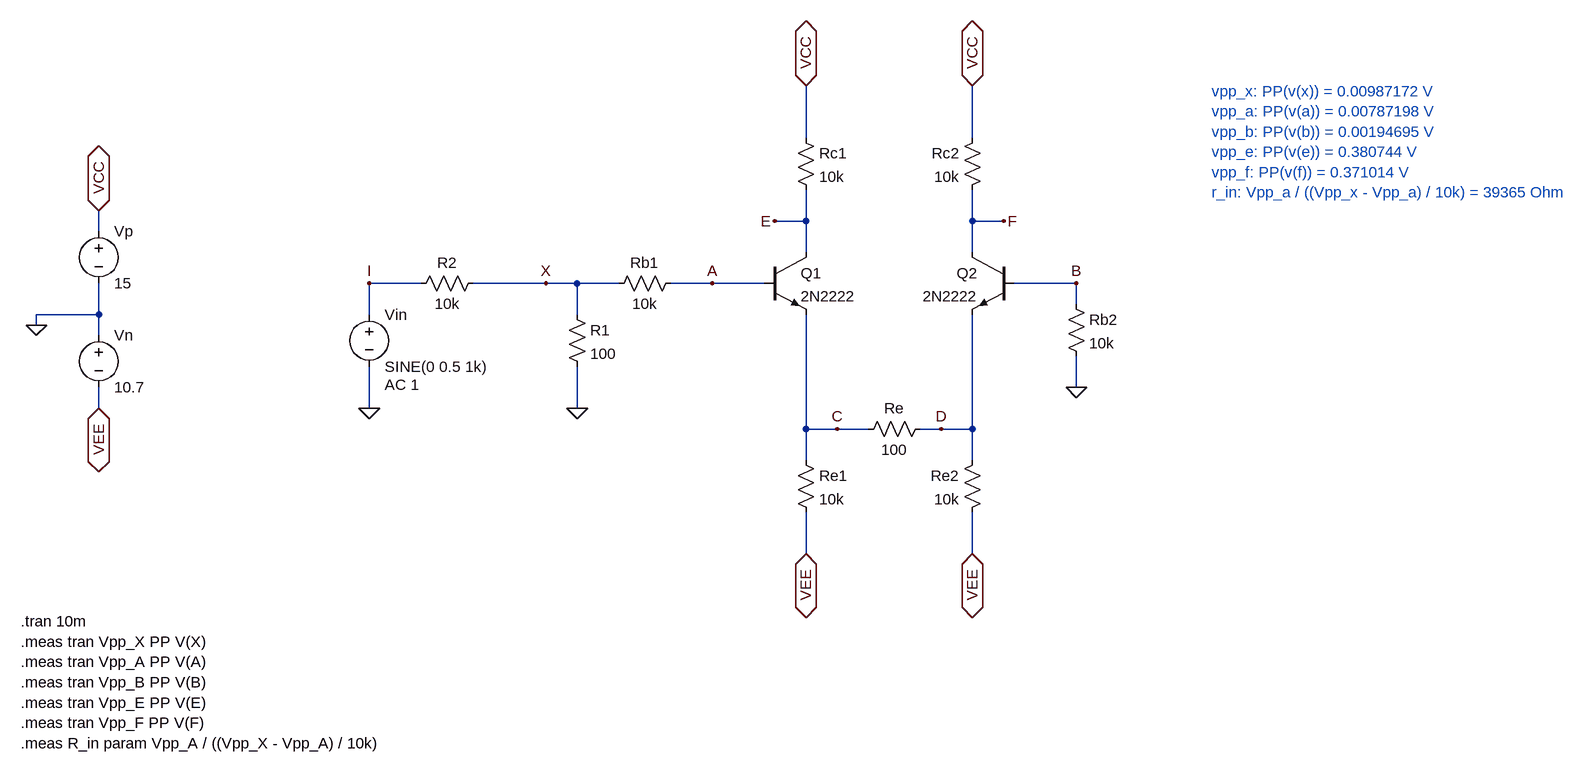
[diagram p0: schematic e1_3_b.asc]
e1_3_b.asc, the LTspice schematic file:
Version 4
SHEET 1 2376 928
WIRE 1136 0 1136 -80
WIRE 1392 0 1392 -80
WIRE 1136 128 1136 80
WIRE 1136 128 1088 128
WIRE 1392 128 1392 80
WIRE 1440 128 1392 128
WIRE 48 144 48 112
WIRE 1136 176 1136 128
WIRE 1392 176 1392 128
WIRE 544 224 464 224
WIRE 736 224 624 224
WIRE 784 224 736 224
WIRE 848 224 784 224
WIRE 992 224 928 224
WIRE 1072 224 992 224
WIRE 1552 224 1456 224
WIRE 1552 256 1552 224
WIRE 48 272 48 224
WIRE 48 272 -48 272
WIRE 464 272 464 224
WIRE 784 272 784 224
WIRE -48 288 -48 272
WIRE 48 304 48 272
WIRE 1552 384 1552 336
WIRE 48 416 48 384
WIRE 464 416 464 352
WIRE 784 416 784 352
WIRE 1136 448 1136 272
WIRE 1184 448 1136 448
WIRE 1232 448 1184 448
WIRE 1344 448 1312 448
WIRE 1392 448 1392 272
WIRE 1392 448 1344 448
WIRE 1136 496 1136 448
WIRE 1392 496 1392 448
WIRE 1136 640 1136 576
WIRE 1392 640 1392 576
FLAG -48 288 0
FLAG 48 112 VCC
IOPIN 48 112 BiDir
FLAG 48 416 VEE
IOPIN 48 416 BiDir
FLAG 784 416 0
FLAG 1136 -80 VCC
IOPIN 1136 -80 BiDir
FLAG 1088 128 E
FLAG 992 224 A
FLAG 1136 640 VEE
IOPIN 1136 640 BiDir
FLAG 1184 448 C
FLAG 1392 -80 VCC
IOPIN 1392 -80 BiDir
FLAG 1440 128 F
FLAG 1552 224 B
FLAG 1392 640 VEE
IOPIN 1392 640 BiDir
FLAG 1344 448 D
FLAG 1552 384 0
FLAG 464 416 0
FLAG 464 224 I
FLAG 736 224 X
SYMBOL voltage 48 128 R0
SYMATTR InstName Vp
SYMATTR Value 15
SYMBOL voltage 48 288 R0
SYMATTR InstName Vn
SYMATTR Value 10.7
SYMBOL npn 1072 176 R0
SYMATTR InstName Q1
SYMATTR Value 2N2222
SYMBOL res 1120 -16 R0
SYMATTR InstName Rc1
SYMATTR Value 10k
SYMBOL res 768 256 R0
SYMATTR InstName R1
SYMATTR Value 100
SYMBOL res 1120 480 R0
SYMATTR InstName Re1
SYMATTR Value 10k
SYMBOL npn 1456 176 M0
SYMATTR InstName Q2
SYMATTR Value 2N2222
SYMBOL res 1408 -16 M0
SYMATTR InstName Rc2
SYMATTR Value 10k
SYMBOL res 1408 480 M0
SYMATTR InstName Re2
SYMATTR Value 10k
SYMBOL voltage 464 256 R0
WINDOW 123 24 124 Left 2
WINDOW 39 0 0 Left 0
SYMATTR Value2 AC 1
SYMATTR InstName Vin
SYMATTR Value SINE(0 0.5 1k)
SYMBOL res 640 208 R90
WINDOW 0 0 56 VBottom 2
WINDOW 3 32 56 VTop 2
SYMATTR InstName R2
SYMATTR Value 10k
SYMBOL res 944 208 R90
WINDOW 0 0 56 VBottom 2
WINDOW 3 32 56 VTop 2
SYMATTR InstName Rb1
SYMATTR Value 10k
SYMBOL res 1536 240 R0
SYMATTR InstName Rb2
SYMATTR Value 10k
SYMBOL res 1328 432 R90
WINDOW 0 0 56 VBottom 2
WINDOW 3 32 56 VTop 2
SYMATTR InstName Re
SYMATTR Value 100
TEXT -72 744 Left 2 !.tran 10m\n.meas tran Vpp_X PP V(X)\n.meas tran Vpp_A PP V(A)\n.meas tran Vpp_B PP V(B)\n.meas tran Vpp_E PP V(E)\n.meas tran Vpp_F PP V(F)\n.meas R_in param Vpp_A / ((Vpp_X - Vpp_A) / 10k)
TEXT 1760 -72 Left 2 ;vpp_x: PP(v(x)) = 0.00987172 V\nvpp_a: PP(v(a)) = 0.00787198 V\nvpp_b: PP(v(b)) = 0.00194695 V\nvpp_e: PP(v(e)) = 0.380744 V\nvpp_f: PP(v(f)) = 0.371014 V\nr_in: Vpp_a / ((Vpp_x - Vpp_a) / 10k) = 39365 Ohm

The netlist it stands for:
* e1_3_b.asc
Vp VCC 0 15
Vn 0 VEE 10.7
Q1 E A C 0 2N2222
Rc1 VCC E 10k
R1 X 0 100
Re1 C VEE 10k
Q2 F B D 0 2N2222
Rc2 VCC F 10k
Re2 D VEE 10k
Vin I 0 SINE(0 0.5 1k) AC 1
R2 X I 10k
Rb1 A X 10k
Rb2 B 0 10k
Re D C 100
.model NPN NPN
.model PNP PNP
.lib standard.bjt
.tran 10m
.meas tran Vpp_X PP V(X)
.meas tran Vpp_A PP V(A)
.meas tran Vpp_B PP V(B)
.meas tran Vpp_E PP V(E)
.meas tran Vpp_F PP V(F)
.meas R_in param Vpp_A / ((Vpp_X - Vpp_A) / 10k)
* vpp_x: PP(v(x)) = 0.00987172 V
* vpp_a: PP(v(a)) = 0.00787198 V
* vpp_b: PP(v(b)) = 0.00194695 V
* vpp_e: PP(v(e)) = 0.380744 V
* vpp_f: PP(v(f)) = 0.371014 V
* r_in: Vpp_a / ((Vpp_x - Vpp_a) / 10k) = 39365 Ohm
.backanno
.end